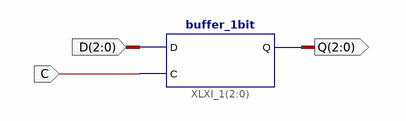
[diagram p0: schematic sheet 1]
// Xilinx ISE schematic buffer_3bit.sch (spartan6) as structural Verilog: 1 symbols, 3 ports
module buffer_3bit (
  input  [2:0] D,
  input  C,
  output [2:0] Q
);

  buffer_1bit XLXI_1[2:0] (.D(D), .C(C), .Q(Q));
endmodule
